# Altium schematic sheet Rear.SchDoc
size A4
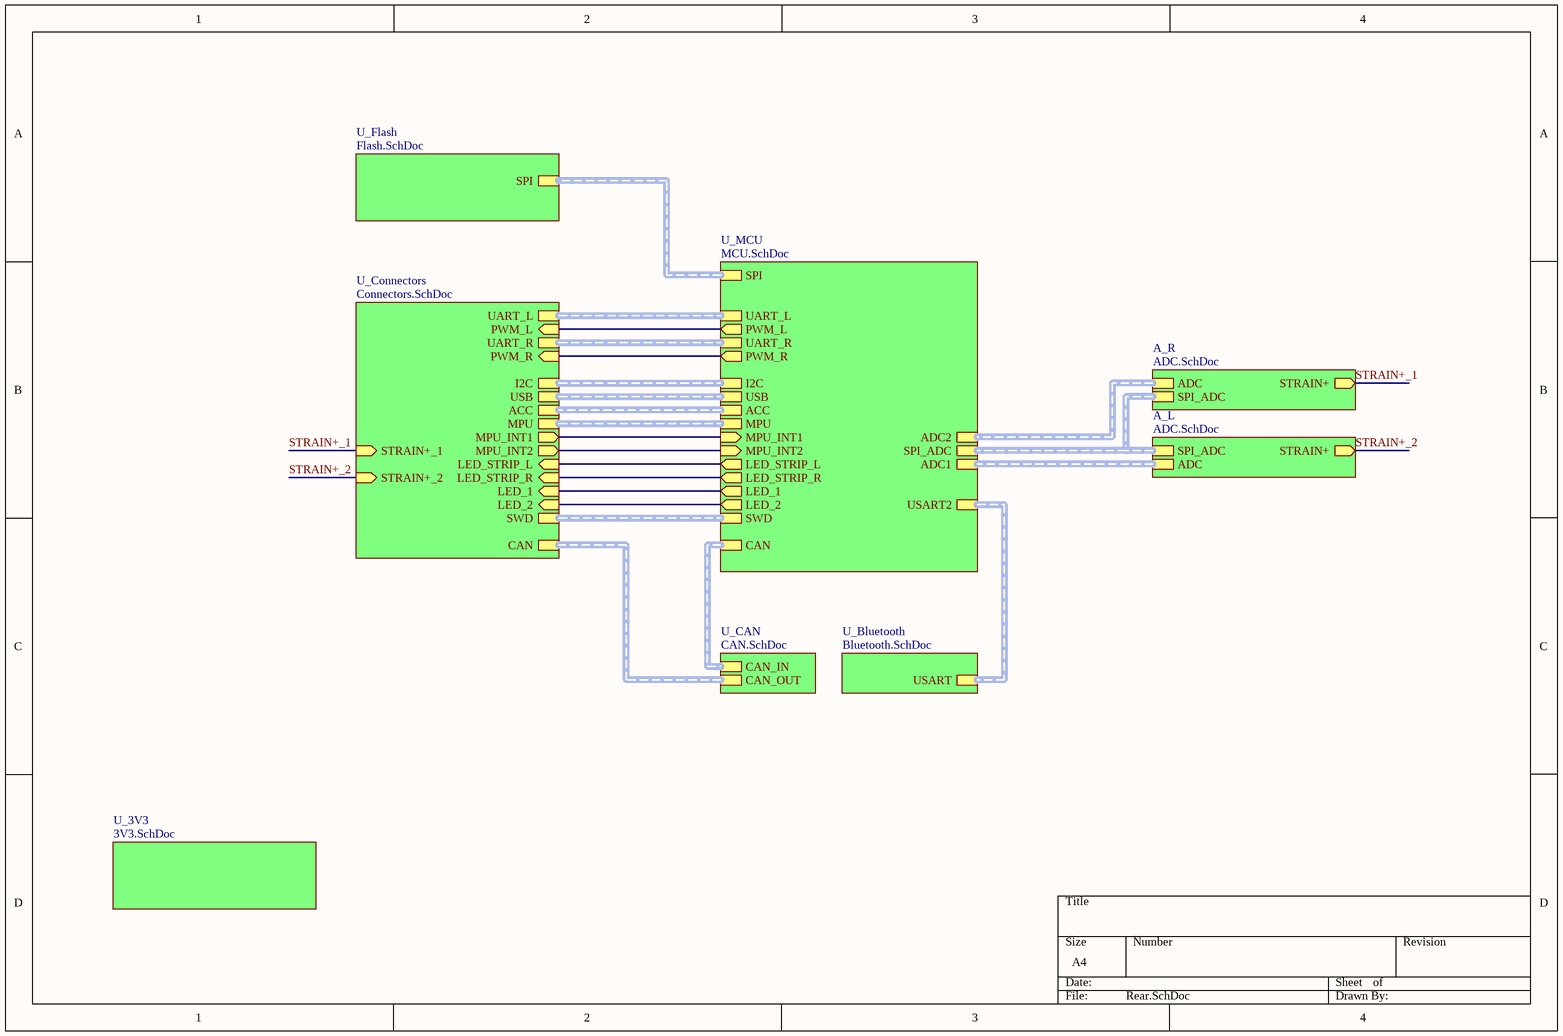
[diagram p0: Rear.SchDoc]

## Sub-sheets
A_L = ADC.SchDoc: SPI_ADC (harness SPI_ADC), ADC (harness ADC), STRAIN+ (out)
A_R = ADC.SchDoc: SPI_ADC (harness SPI_ADC), ADC (harness ADC), STRAIN+ (out)
U_3V3 = 3V3.SchDoc: no entries
U_Bluetooth = Bluetooth.SchDoc: USART (harness UART)
U_CAN = CAN.SchDoc: CAN_IN (harness CAN Input), CAN_OUT (harness CAN Output)
U_Connectors = Connectors.SchDoc: USB (harness USB), ACC (harness Accessory Outputs), CAN (harness CAN Output), MPU (harness I2C), MPU_INT1 (out), MPU_INT2 (out), STRAIN+_1 (in), STRAIN+_2 (in), LED_STRIP_L (in), LED_STRIP_R (in), SWD (harness SWD), LED_1 (in), LED_2 (in), UART_L (harness UART), UART_R (harness UART), PWM_L (in), PWM_R (in), I2C (harness I2C)
U_Flash = Flash.SchDoc: SPI (harness SPI)
U_MCU = MCU.SchDoc: USB (harness USB), CAN (harness CAN Input), ACC (harness Accessory Outputs), I2C (harness I2C), SPI_ADC (harness SPI_ADC), USART2 (harness UART), ADC1 (harness ADC), ADC2 (harness ADC), MPU (harness I2C), MPU_INT1 (in), MPU_INT2 (in), SPI, LED_STRIP_L (out), LED_STRIP_R (out), SWD (harness SWD), LED_1 (out), LED_2 (out), UART_L (harness UART), UART_R (harness UART), PWM_L (out), PWM_R (out)

## Nets
STRAIN+_1: sheet A_R/STRAIN+, sheet U_Connectors/STRAIN+_1
STRAIN+_2: sheet A_L/STRAIN+, sheet U_Connectors/STRAIN+_2
(unnamed): sheet U_MCU/MPU_INT1, sheet U_Connectors/MPU_INT1
(unnamed): sheet U_MCU/MPU_INT2, sheet U_Connectors/MPU_INT2
(unnamed): sheet U_MCU/LED_STRIP_L, sheet U_Connectors/LED_STRIP_L
(unnamed): sheet U_MCU/LED_STRIP_R, sheet U_Connectors/LED_STRIP_R
(unnamed): sheet U_MCU/LED_1, sheet U_Connectors/LED_1
(unnamed): sheet U_MCU/LED_2, sheet U_Connectors/LED_2
(unnamed): sheet U_MCU/PWM_L, sheet U_Connectors/PWM_L
(unnamed): sheet U_MCU/PWM_R, sheet U_Connectors/PWM_R

## Buses and harness runs
harness sheet A_L/ADC = sheet U_MCU/ADC1
harness sheet A_L/SPI_ADC = sheet A_R/SPI_ADC = sheet U_MCU/SPI_ADC
harness sheet A_R/ADC = sheet U_MCU/ADC2
harness sheet U_Bluetooth/USART = sheet U_MCU/USART2
harness sheet U_CAN/CAN_IN = sheet U_MCU/CAN
harness sheet U_CAN/CAN_OUT = sheet U_Connectors/CAN
harness sheet U_Connectors/ACC = sheet U_MCU/ACC
harness sheet U_Connectors/I2C = sheet U_MCU/I2C
harness sheet U_Connectors/MPU = sheet U_MCU/MPU
harness sheet U_Connectors/SWD = sheet U_MCU/SWD
harness sheet U_Connectors/UART_L = sheet U_MCU/UART_L
harness sheet U_Connectors/UART_R = sheet U_MCU/UART_R
harness sheet U_Connectors/USB = sheet U_MCU/USB
harness sheet U_Flash/SPI = sheet U_MCU/SPI